# Altium schematic sheet Charge Amp.SchDoc
size A
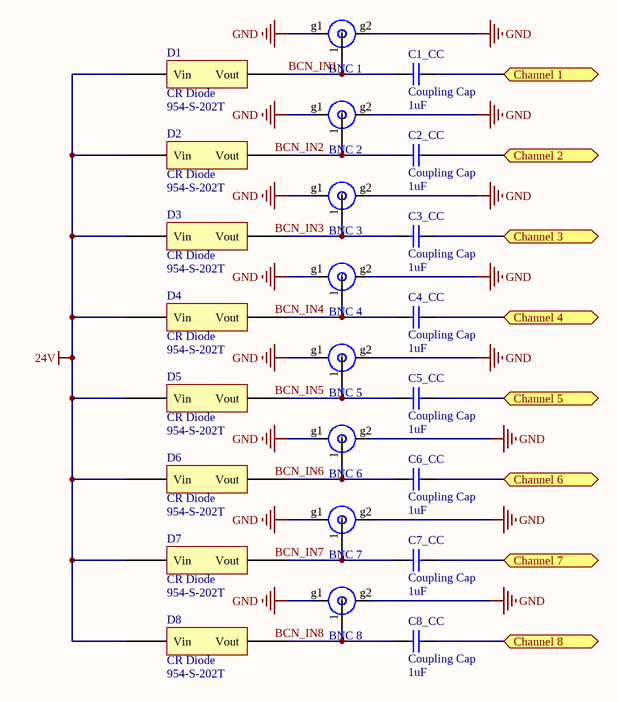
[diagram p0: Charge Amp.SchDoc]

## Parts
BNC_1  Component_1  [BNC 50OHM EDGE ACX2259]  (value not drawn)
BNC_2  Component_1  [BNC 50OHM EDGE ACX2259]  (value not drawn)
BNC_3  Component_1  [BNC 50OHM EDGE ACX2259]  (value not drawn)
BNC_4  Component_1  [BNC 50OHM EDGE ACX2259]  (value not drawn)
BNC_5  Component_1  [BNC 50OHM EDGE ACX2259]  (value not drawn)
BNC_6  Component_1  [BNC 50OHM EDGE ACX2259]  (value not drawn)
BNC_7  Component_1  [BNC 50OHM EDGE ACX2259]  (value not drawn)
BNC_8  Component_1  [BNC 50OHM EDGE ACX2259]  (value not drawn)
C1_CC  Coupling Cap  value 1uF  [6-0805_N]
C2_CC  Coupling Cap  value 1uF  [6-0805_N]
C3_CC  Coupling Cap  value 1uF  [6-0805_N]
C4_CC  Coupling Cap  value 1uF  [6-0805_N]
C5_CC  Coupling Cap  value 1uF  [6-0805_N]
C6_CC  Coupling Cap  value 1uF  [6-0805_N]
C7_CC  Coupling Cap  value 1uF  [6-0805_N]
C8_CC  Coupling Cap  value 1uF  [6-0805_N]
D1  CR Diode  Supplier Part Number 1: 954-S-202T  [CR Diode - duplicate1]
D2  CR Diode  Supplier Part Number 1: 954-S-202T  [CR Diode - duplicate1]
D3  CR Diode  Supplier Part Number 1: 954-S-202T  [CR Diode - duplicate1]
D4  CR Diode  Supplier Part Number 1: 954-S-202T  [CR Diode - duplicate1]
D5  CR Diode  Supplier Part Number 1: 954-S-202T  [CR Diode - duplicate1]
D6  CR Diode  Supplier Part Number 1: 954-S-202T  [CR Diode - duplicate1]
D7  CR Diode  Supplier Part Number 1: 954-S-202T  [CR Diode - duplicate1]
D8  CR Diode  Supplier Part Number 1: 954-S-202T  [CR Diode - duplicate1]

## Ports
Channel 1, Channel 2, Channel 3, Channel 4, Channel 5, Channel 6, Channel 7, Channel 8

## Nets
24V: D1.a(Vin) D2.a(Vin) D3.a(Vin) D4.a(Vin) D5.a(Vin) D6.a(Vin) D7.a(Vin) D8.a(Vin)
GND: BNC_1.g1 BNC_1.g2(0) BNC_2.g1 BNC_2.g2(0) BNC_3.g1 BNC_3.g2(0) BNC_4.g1 BNC_4.g2(0) BNC_5.g1 BNC_5.g2(0) BNC_6.g1 BNC_6.g2(0) BNC_7.g1 BNC_7.g2(0) BNC_8.g1 BNC_8.g2(0)
BCN_IN1: BNC_1.1(Signal) C1_CC.1 D1.k(Vout)
Channel 1: C1_CC.2 ; port Channel 1
Channel 2: C2_CC.2 ; port Channel 2
Channel 3: C3_CC.2 ; port Channel 3
Channel 4: C4_CC.2 ; port Channel 4
Channel 5: C5_CC.2 ; port Channel 5
Channel 6: C6_CC.2 ; port Channel 6
Channel 7: C7_CC.2 ; port Channel 7
Channel 8: C8_CC.2 ; port Channel 8
NetBNC_2_1: BNC_2.1(Signal) C2_CC.1 D2.k(Vout)
NetBNC_3_1: BNC_3.1(Signal) C3_CC.1 D3.k(Vout)
NetBNC_4_1: BNC_4.1(Signal) C4_CC.1 D4.k(Vout)
NetBNC_5_1: BNC_5.1(Signal) C5_CC.1 D5.k(Vout)
NetBNC_6_1: BNC_6.1(Signal) C6_CC.1 D6.k(Vout)
NetBNC_7_1: BNC_7.1(Signal) C7_CC.1 D7.k(Vout)
NetBNC_8_1: BNC_8.1(Signal) C8_CC.1 D8.k(Vout)

## Notes on the sheet
- Labels drawn without touching a wire or pin: BCN_IN2, BCN_IN3, BCN_IN4, BCN_IN5, BCN_IN6, BCN_IN7, BCN_IN8

## Library data of the parts
BNC_1-BNC_8 = Component_1: CONN BNC JACK 50 OHM EDGE MNT; Supplier 1: Digi-Key; Supplier Part Number 1: ACX2259-ND
C1_CC C2_CC C3_CC C4_CC C5_CC C6_CC C7_CC C8_CC = Cap Semi: Capacitor (Semiconductor SIM Model); Published: 8-Jun-2000; LatestRevisionDate: 29-May-2009; LatestRevisionNote: IPC-7351 Footprint Added.; PackageReference: C1206; Publisher: Altium Limited; PackageDescription: Chip Capacitor; Supplier 1: Digi-Key; Supplier Part Number 1: 1276-1066-1-ND
D1-D8 = Diode_1: Current Regulator Diodes 100V 2mA; Supplier 1: Mouser